# Altium schematic sheet Connectors.SchDoc
size 420 x 297 mm; SheetNumber: 6; SheetTotal: 6
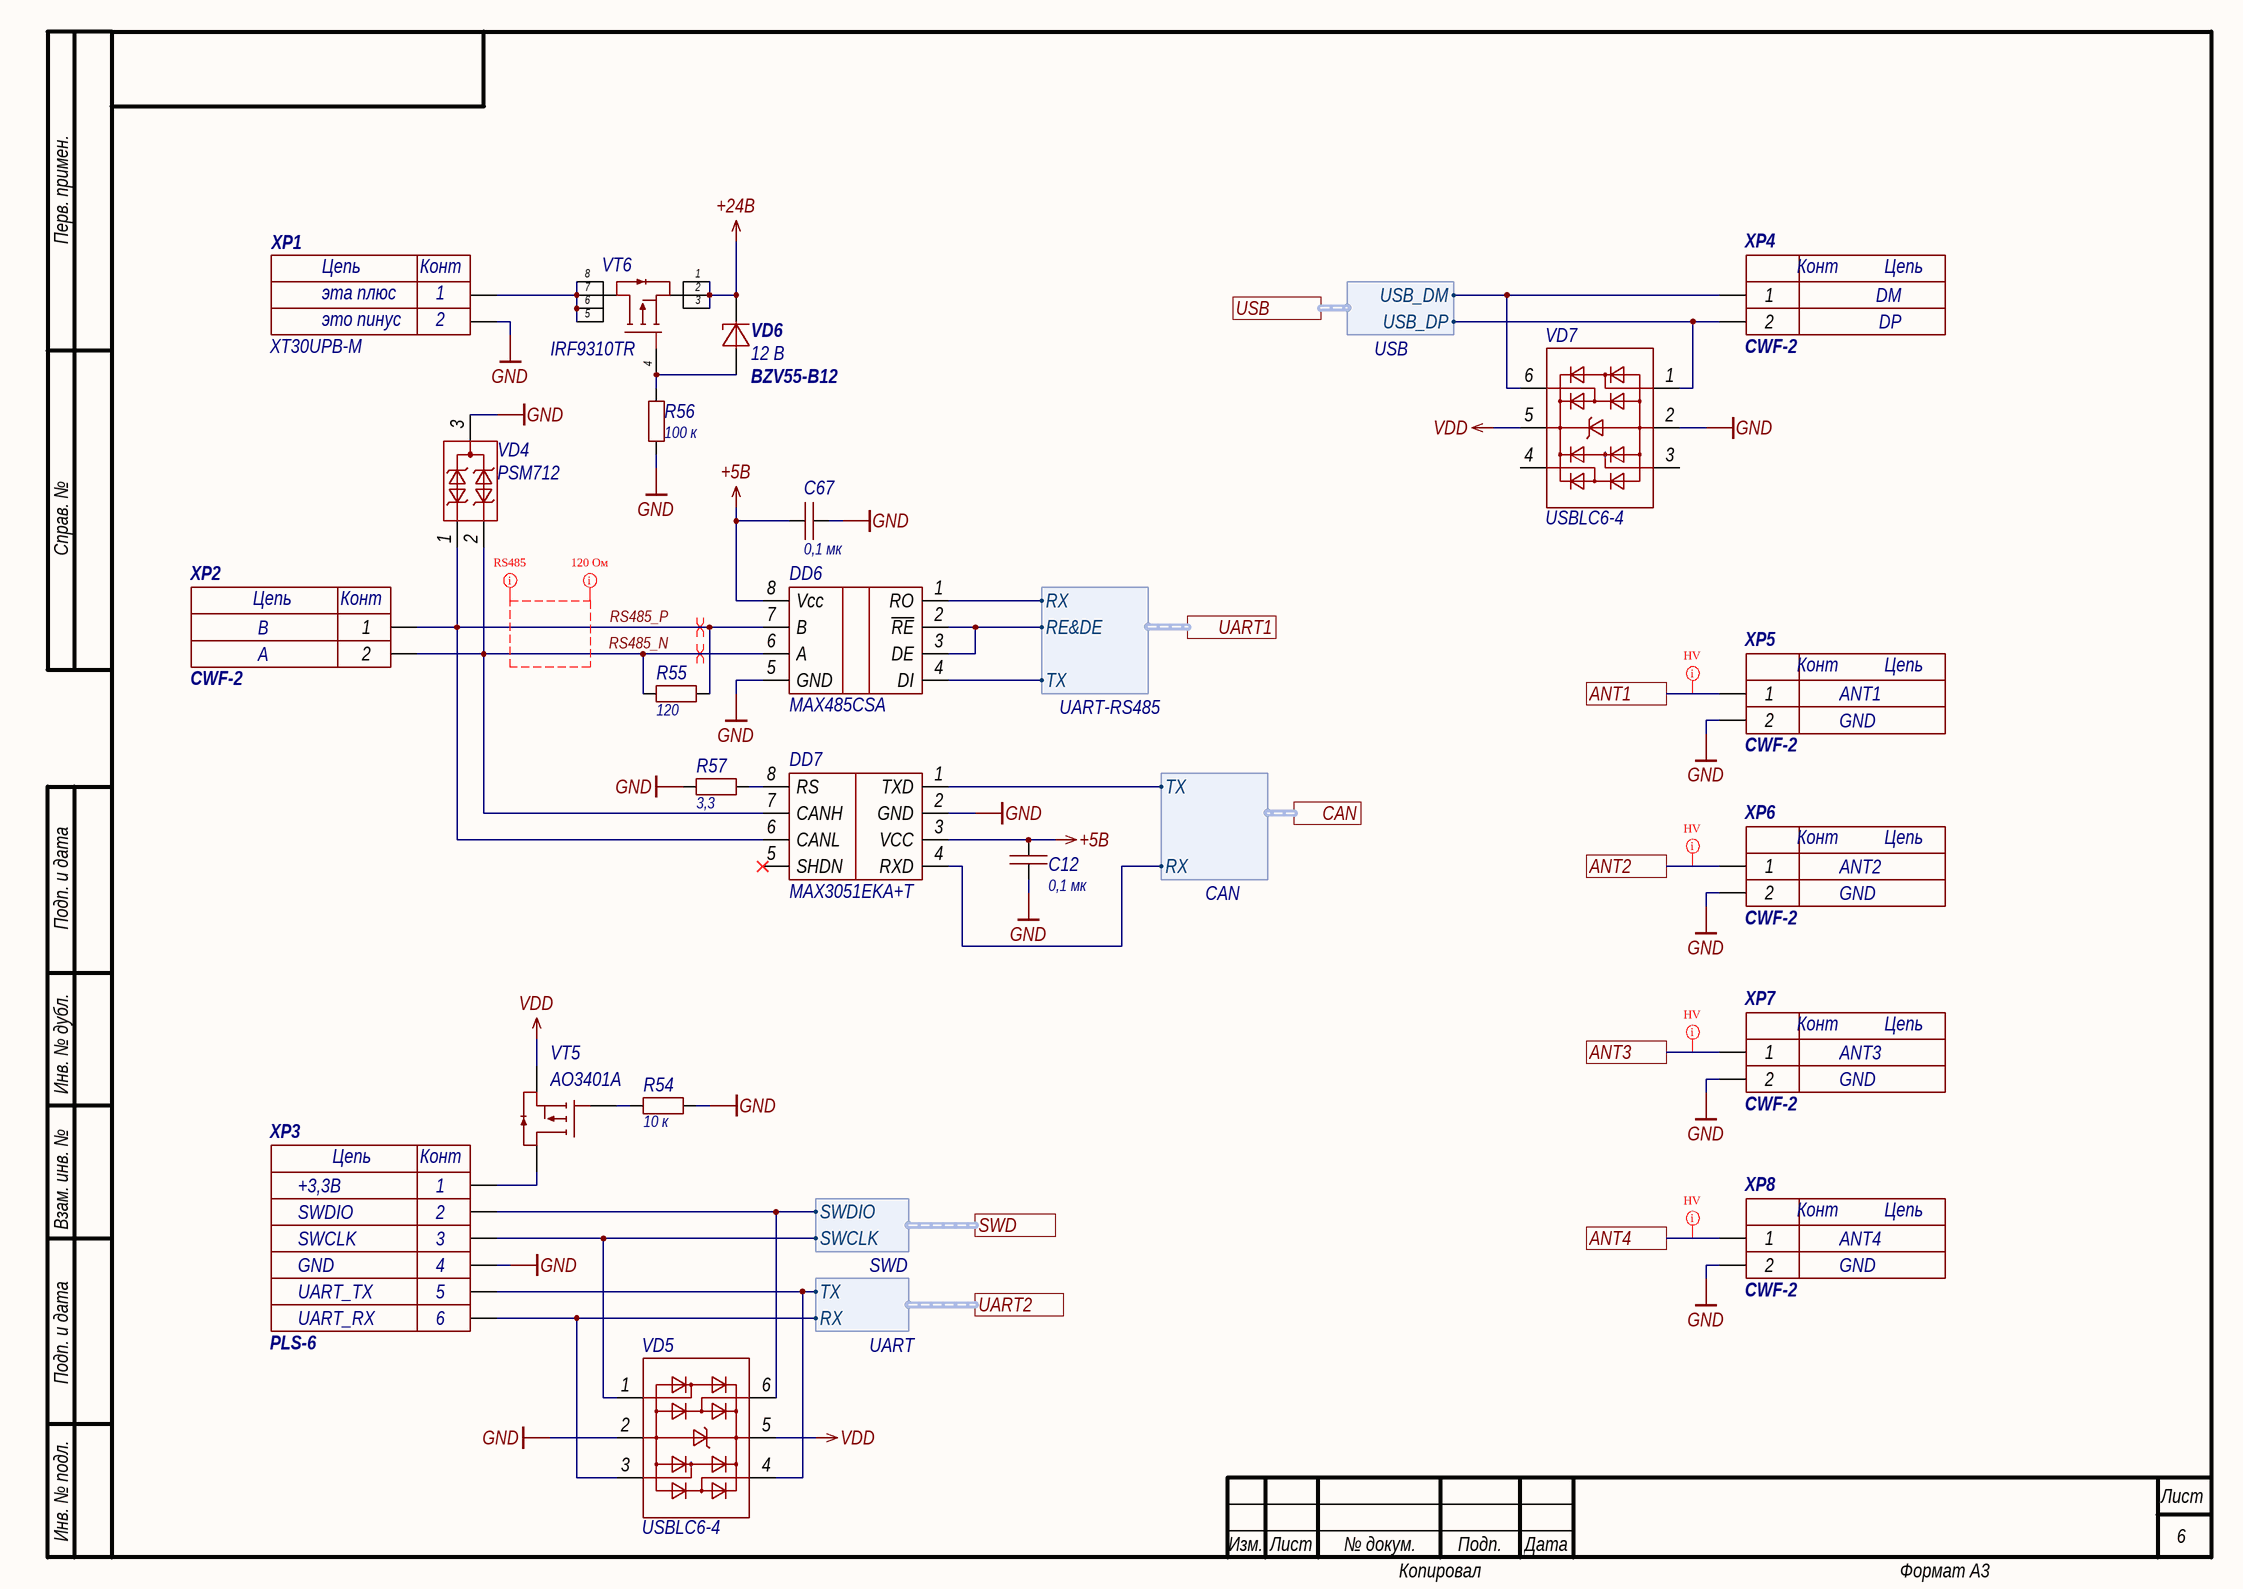
[diagram p0: Connectors.SchDoc]

## Parts
C12  value 0,1 мк  [0603C]  (hidden comment: Capacitor)
C67  value 0,1 мк  [0603C]  (hidden comment: Capacitor)
DD6  MAX485CSA  [SOIC-8]
DD7  MAX3051EKA+T  [SOT23-8]
R54  value 10 к  [0603R]  (hidden comment: Resistor)
R55  value 120  [1206R]  (hidden comment: Resistor)
R56  value 100 к  [0603R]  (hidden comment: Resistor)
R57  value 3,3  [0603R]  (hidden comment: Resistor)
VD4  PSM712  [SOT23-3]
VD5  USBLC6-4  [SOT23-6]
VD6  BZV55-B12  value 12 В  [mini_MELF_3.5mm]
VD7  USBLC6-4  [SOT23-6]
VT5  AO3401A  [SOT23-3]
VT6  IRF9310TR  [SOIC-8]
XP1  XT30UPB-M  Value2: это пинус  Value1: эта плюс  [XT30UPB-M]
XP2  CWF-2  [CWF-2]
XP3  PLS-6  [PLS6]
XP4  CWF-2  Value2: DP  Value1: DM  [CWF-2]
XP5  CWF-2  [CWF-2]
XP6  CWF-2  [CWF-2]
XP7  CWF-2  [CWF-2]
XP8  CWF-2  [CWF-2]

## Ports
ANT1, ANT2, ANT3, ANT4, CAN (harness CAN), SWD (harness SWD), UART1 (harness UART-RS485), UART2 (harness UART), USB (harness USB)

## Harnesses
SWD: SWDIO, SWCLK
UART: TX, RX
USB: USB_DM, USB_DP
UART-RS485: TX, RX, RE&DE
CAN: TX, RX

## Nets
+5В: C12.2 C67.1 DD6.8(Vcc) DD7.3(VCC)
+24В: VD6.2 VT6.1 VT6.2 VT6.3
GND: C12.1 C67.2 DD6.5(GND) DD7.2(GND) R54.1 R56.1 R57.1 VD4.3 VD5.2 VD7.2 XP1.N XP3.4 XP5.2 XP6.2 XP7.2 XP8.2
VDD: VD5.5 VD7.5 VT5.2
ANT1: XP5.1 ; port ANT1
ANT2: XP6.1 ; port ANT2
ANT3: XP7.1 ; port ANT3
ANT4: XP8.1 ; port ANT4
RS485_N: DD6.6(A) DD7.7(CANH) R55.1 VD4.2 XP2.2
RS485_P: DD6.7(B) DD7.6(CANL) R55.2 VD4.1 XP2.1
NetDD6_1: DD6.1(RO) ; port UART1.RX
NetDD6_2: DD6.2(~{RE}) DD6.3(DE) ; port UART1.RE&DE
NetDD6_4: DD6.4(DI) ; port UART1.TX
NetDD7_1: DD7.1(TXD) ; port CAN.TX
NetDD7_4: DD7.4(RXD) ; port CAN.RX
NetDD7_8: DD7.8(RS) R57.2
NetR54_2: R54.2 VT5.1
NetR56_2: R56.2 VD6.1 VT6.4
NetVD5_1: VD5.1 XP3.3 ; port SWD.SWCLK
NetVD5_3: VD5.3 XP3.6 ; port UART2.RX
NetVD5_4: VD5.4 XP3.5 ; port UART2.TX
NetVD5_6: VD5.6 XP3.2 ; port SWD.SWDIO
NetVD7_1: VD7.1 XP4.2 ; port USB.USB_DP
NetVD7_6: VD7.6 XP4.1 ; port USB.USB_DM
NetVT5_3: VT5.3 XP3.1
NetVT6_5: VT6.5 VT6.6 VT6.7 VT6.8 XP1.P

Not connected (* = marked no-connect by the designer): DD7 5(SHDN)*; VD7 3(11) 4(12)

## Layout directives
differential pair: RS485_N, RS485_P
mark named RS485: (no net found under the mark)
net class 120OhmDiff: (no net found under the mark)
net class HV; rule Clearance Constraint [Clearance = 1mm]: ANT1, ANT2, ANT3, ANT4

## Notes on the sheet
- B
- A
- ANT1
- GND
- ANT2
- ANT3
- +3,3В
- SWDIO
- SWCLK
- ANT4
- UART_TX
- UART_RX
- Перв. примен.
- Справ. №
- Подп. и дата
- Инв. № дубл.
- Взам. инв. №
- Инв. № подл.
- Изм.
- Лист
- № докум.
- Подп.
- Дата
- Копировал
- Формат А3
- (in symbol CWF-2) Конт; Цепь
- (in symbol PLS-6) Цепь; Конт
- (in symbol XT30UPB-M) Цепь; Конт; 1; 2

## Library data of the parts
C12 C67 = Capacitor_0,1u_10_50V_X7R_0603C: Конденсатор 0603C ёмкостью 0,1 мк 10%, 50 В, X7R; Voltage (V): 50; Capacity (nF): 100; Part Number: Capacitor_0,1u_10_50V_X7R_0603C; Tolerance: 10%; Dielectric: X7R
DD6 = MAX485CSA: RS-485 приёмопередатчик; Part Number: MAX485CSA
DD7 = MAX3051EKA+T: CAN трансивер 1Mbps +3.3В; Автор: glebmih; Part Number: MAX3051EKA+T; Datasheet: https://static.chipdip.ru/lib/876/DOC015876362.pdf
R54 = Resistor_10k_1_0603: Резистор номиналом 10 кОм 1%; Power: *; Part Number: Resistor_10k_1_0603; Tolerance: 1%
R55 = Resistor_120_1_1206: Резистор номиналом 120 Ом 1%; Автор: glebmih; Power: *; Part Number: Resistor_120_1_1206; Tolerance: 1%
R56 = Resistor_100k_1_0603: Резистор номиналом 100 кОм 1%; Power: *; Part Number: Resistor_100k_1_0603; Tolerance: 1%
R57 = Resistor_3.3_1_0603: Резистор номиналом 3,3 Ом 1%; Power: *; Part Number: Resistor_3.3_1_0603; Tolerance: 1%
VD4 = PSM712: Защитный диод для линии RS-485; Part Number: PSM712; Interface: RS-485
VD5 VD7 = USBLC6-4: Сборка защитных диодов для USB; ComponentLink1Description: Shop; ComponentLink1URL: https://www.chipdip.ru/product0/8001780508; Part Number: USBLC6-4
VD6 = BZV55-B12: Стабилитрон 12В, 5%, 0.5Вт; Voltage (V): 12; Current: 5 мА; Power (W): 0.5; Accuracy: 0,02; Автор: rreali; Part Number: BZV55-B12
VT5 = AO3401A: P-канальный MOSFET; Part Number: AO3401A
VT6 = IRF9310TR: P-канальный MOSFET, 30 В, 20 А; Voltage (V): 30 В; Current (A): 20 А; Автор: glebmih; Part Number: IRF9310TR
XP1 = XT30UPB-M: 2-пиновый разъем с ключом; System: Connector; Автор: rreali; Part Number: XT30UPB-M
XP2 XP4 = CWF-2: 2-пиновый разъем с ключом; System: Connector; Автор: rreali; Part Number: CWF-2; Datasheet: https://static.chipdip.ru/lib/413/DOC001413777.pdf
XP3 = PLS-6: Гребенка 6 пинов; Value1: {Value1}; Value2: {Value2}; Value3: {Value3}; Value4: {Value4}; Value5: {Value5}; Value6: {Value6}; System: Connector; Автор: glebmih; Part Number: PLS-6
XP5-XP8 = CWF-2: 2-пиновый разъем с ключом; Value2: {Value2}; Value1: {Value1}; System: Connector; Автор: rreali; Part Number: CWF-2; Datasheet: https://static.chipdip.ru/lib/413/DOC001413777.pdf